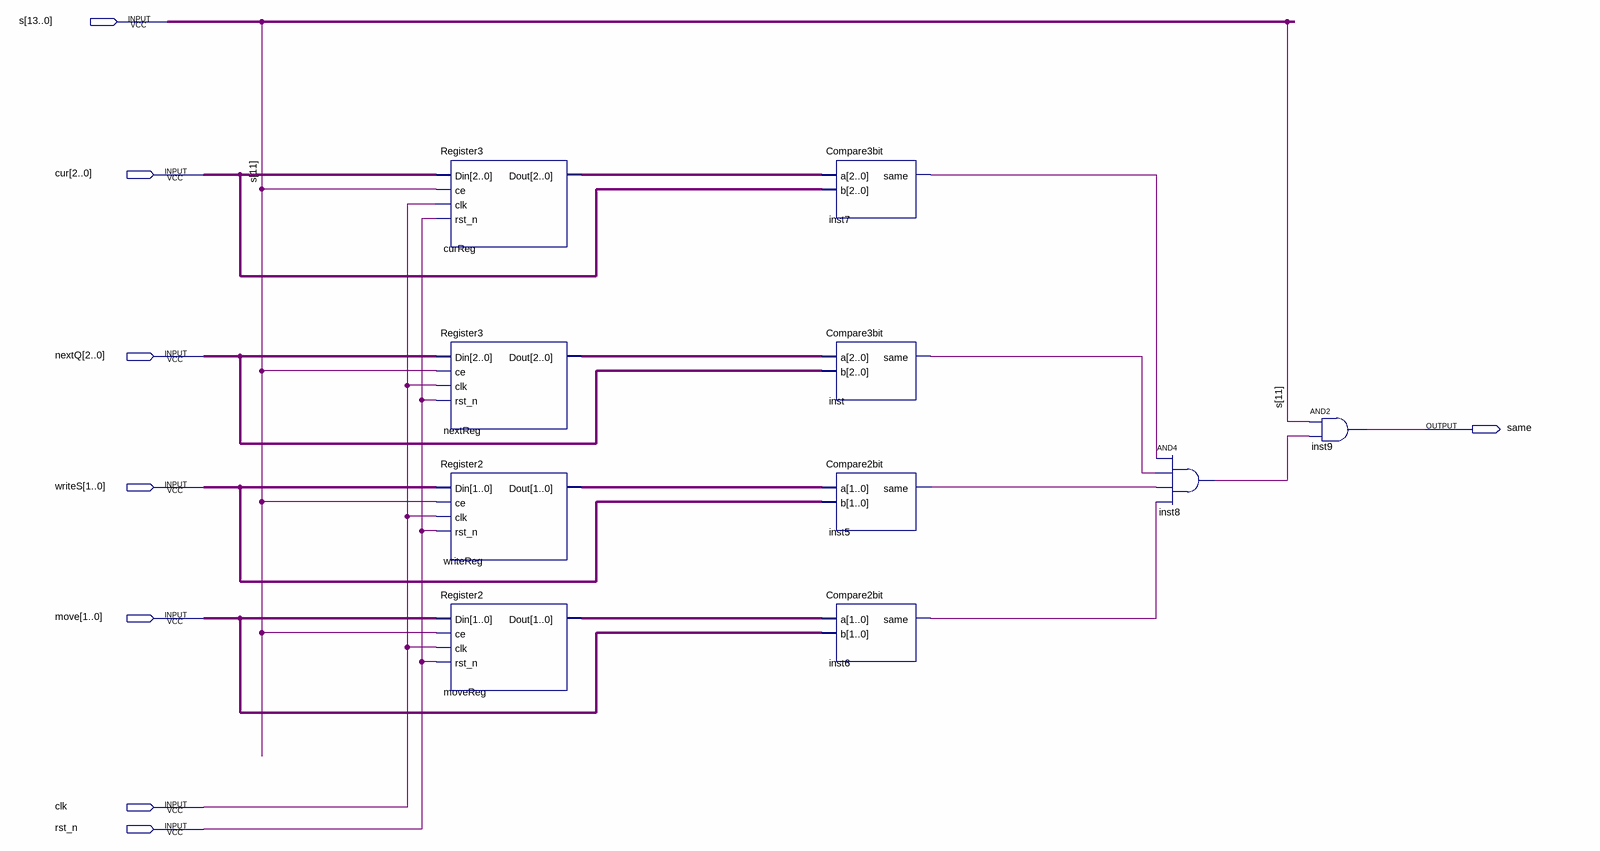
[diagram p0: schematic sheet]
// Quartus schematic IsStable.bdf as structural Verilog: 10 symbols, 8 pins
module IsStable (
  input  [13:0] s,
  input  [2:0] cur,
  input  [2:0] nextQ,
  input  [1:0] writeS,
  input  [1:0] move,
  input  clk,
  input  rst_n,
  output same
);

  wire inst5_same, inst6_same, inst7_same, inst8_out, inst_same;
  wire [1:0] moveReg_dout, writeReg_dout;
  wire [2:0] curReg_dout, nextReg_dout;

  Register3 curReg (.Din(cur), .ce(s[11]), .clk(clk), .rst_n(rst_n), .Dout(curReg_dout));
  Register3 nextReg (.Din(nextQ), .ce(s[11]), .clk(clk), .rst_n(rst_n), .Dout(nextReg_dout));
  Register2 writeReg (.Din(writeS), .ce(s[11]), .clk(clk), .rst_n(rst_n), .Dout(writeReg_dout));
  Register2 moveReg (.Din(move), .ce(s[11]), .clk(clk), .rst_n(rst_n), .Dout(moveReg_dout));
  Compare3bit inst7 (.a(curReg_dout), .b(cur), .same(inst7_same));
  Compare3bit inst (.a(nextReg_dout), .b(nextQ), .same(inst_same));
  Compare2bit inst5 (.a(writeReg_dout), .b(writeS), .same(inst5_same));
  Compare2bit inst6 (.a(moveReg_dout), .b(move), .same(inst6_same));
  and inst8 (inst8_out, inst7_same, inst_same, inst5_same, inst6_same);
  and inst9 (same, s[11], inst8_out);
endmodule
